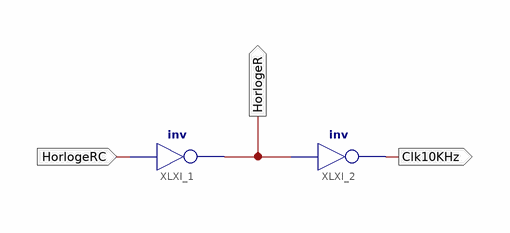
[diagram p0: schematic sheet 1]
// Xilinx ISE schematic H10KHz.sch (xbr) as structural Verilog: 2 symbols, 3 ports
module H10KHz (
  input  HorlogeRC,
  output HorlogeR,
  output Clk10KHz
);

  not XLXI_1 (HorlogeR, HorlogeRC);
  not XLXI_2 (Clk10KHz, HorlogeR);
endmodule
